# EAGLE design clockshield (EAGLE 5.11)
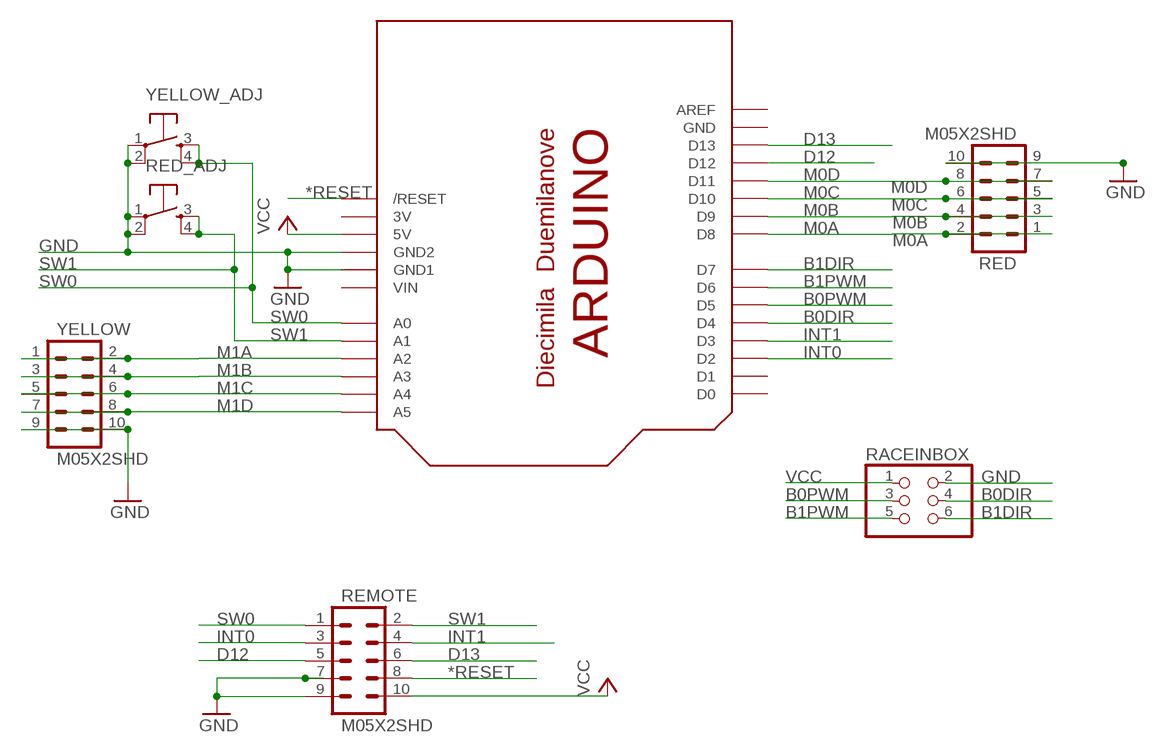
[diagram p0: schematic, sheet 1]

## Parts
RACEINBOX  PINHD-2X3  [2X03]
RED  M05X2SHD  [2X5-SHROUDED]
RED_ADJ  TAC_SWITCHPTH  [TACTILE-PTH]
REMOTE  M05X2SHD  [2X5-SHROUDED]
U$1  ARDUINO-BPLACE  [ARDUINO-BPLACE]
YELLOW  M05X2SHD  [2X5-SHROUDED]
YELLOW_ADJ  TAC_SWITCHPTH  [TACTILE-PTH]

## Nets
*RESET: REMOTE.8 U$1.RESET(/RESET)
B0DIR: RACEINBOX.4 U$1.D4
B0PWM: RACEINBOX.3 U$1.D5
B1DIR: RACEINBOX.6 U$1.D7
B1PWM: RACEINBOX.5 U$1.D6
D12: REMOTE.5 U$1.D12
D13: REMOTE.6 U$1.D13
GND: RACEINBOX.2 RED.9 RED.10 RED_ADJ.1 RED_ADJ.2 REMOTE.7 REMOTE.9 U$1.GND1 U$1.GND2 YELLOW.9 YELLOW.10 YELLOW_ADJ.1 YELLOW_ADJ.2
INT0: REMOTE.3 U$1.D2
INT1: REMOTE.4 U$1.D3
M0A: RED.1 RED.2 U$1.D8
M0B: RED.3 RED.4 U$1.D9
M0C: RED.5 RED.6 U$1.D10
M0D: RED.7 RED.8 U$1.D11
M1A: U$1.A2 YELLOW.1 YELLOW.2
M1B: U$1.A3 YELLOW.3 YELLOW.4
M1C: U$1.A4 YELLOW.5 YELLOW.6
M1D: U$1.A5 YELLOW.7 YELLOW.8
SW0: REMOTE.1 U$1.A0 YELLOW_ADJ.3 YELLOW_ADJ.4
SW1: RED_ADJ.3 RED_ADJ.4 REMOTE.2 U$1.A1
VCC: RACEINBOX.1 REMOTE.10 U$1.5V
Unconnected: U$1.AREF U$1.D0 U$1.D1

## Power pins joined to a net without a drawn wire
3V: U$1.3V
GND: U$1.GND
VIN: U$1.VIN

## Library data of the parts
RACEINBOX = pinhead:PINHD-2X3: PIN HEADER
RED REMOTE YELLOW = 3d2011:M05X2: Header 5x2 Standard 10-pin dual row 0.1" header. Commonly used with AVR-ISP. Use with Spark Fun Electronics SKU: PRT-00778
RED_ADJ YELLOW_ADJ = 3d2011:TAC_SWITCH: Momentary Switch Button commonly used for reset or general input. Spark Fun Electronics SKU : COM-00097
U$1 = adafruit:ARDUINO: Arduino Diecimila/Duemilanove Make a shield with ease, this package has all the named pins as well as the two mounting drill holes and an outline of the USB and DC power connector. The outline is on the DIMENSION layer, so if your board house uses it they will cut the outline to match. http://www.ladyada.net/library/pcb/eaglelibrary.html

## Net classes
0 default: width 0.203 mm

## Board
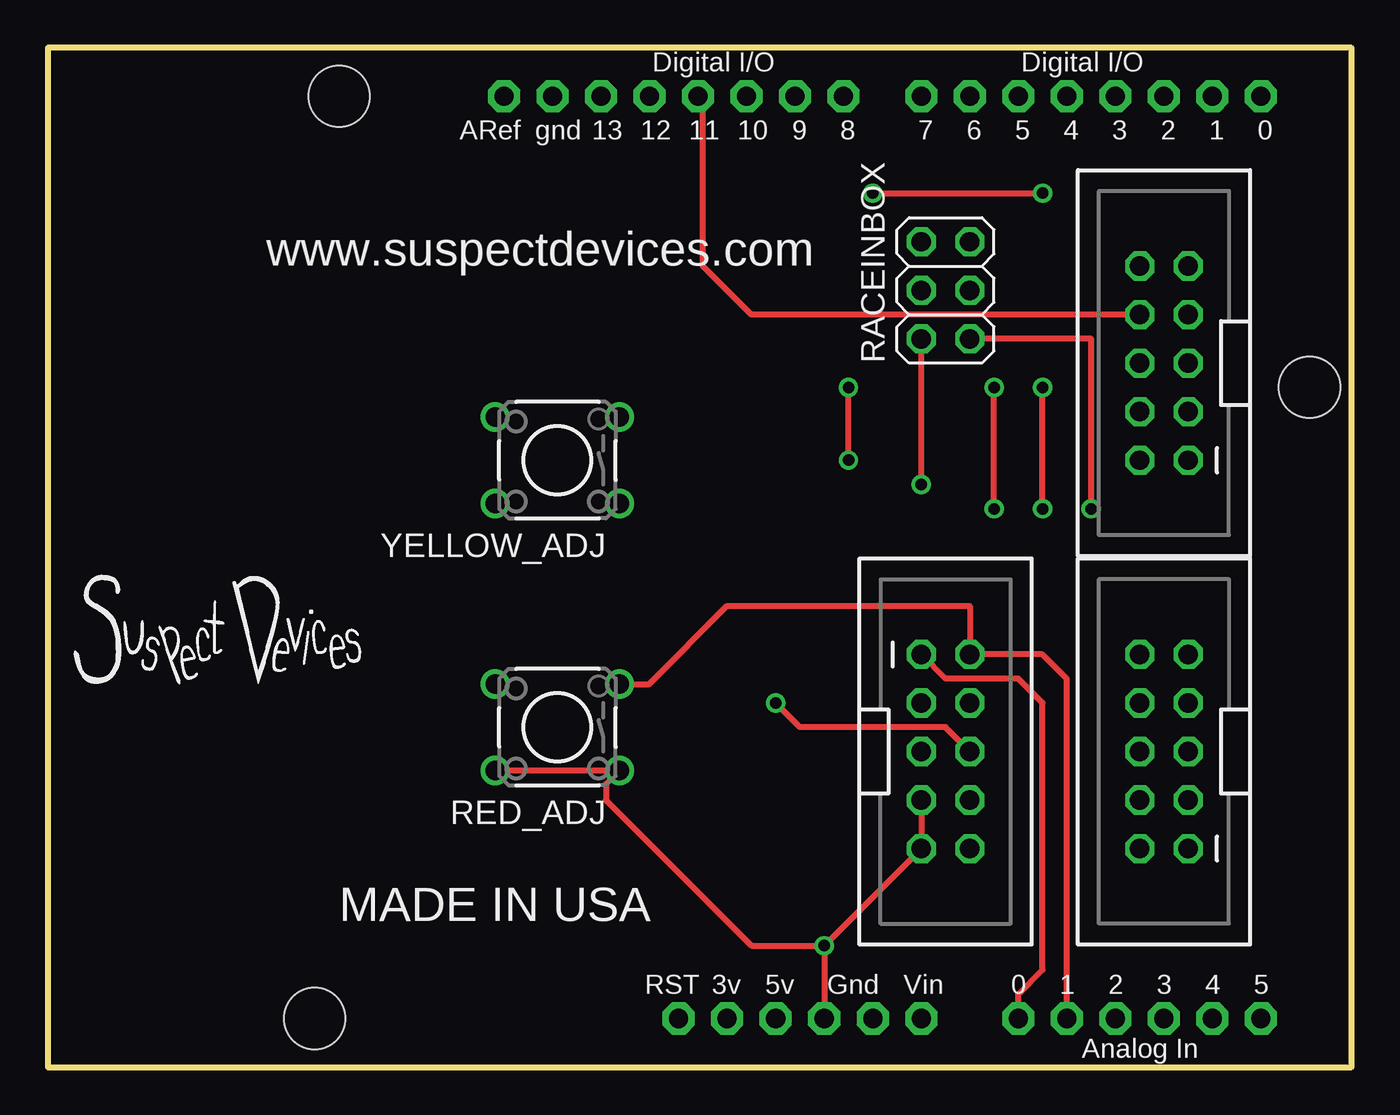
[diagram p1: board, top side]
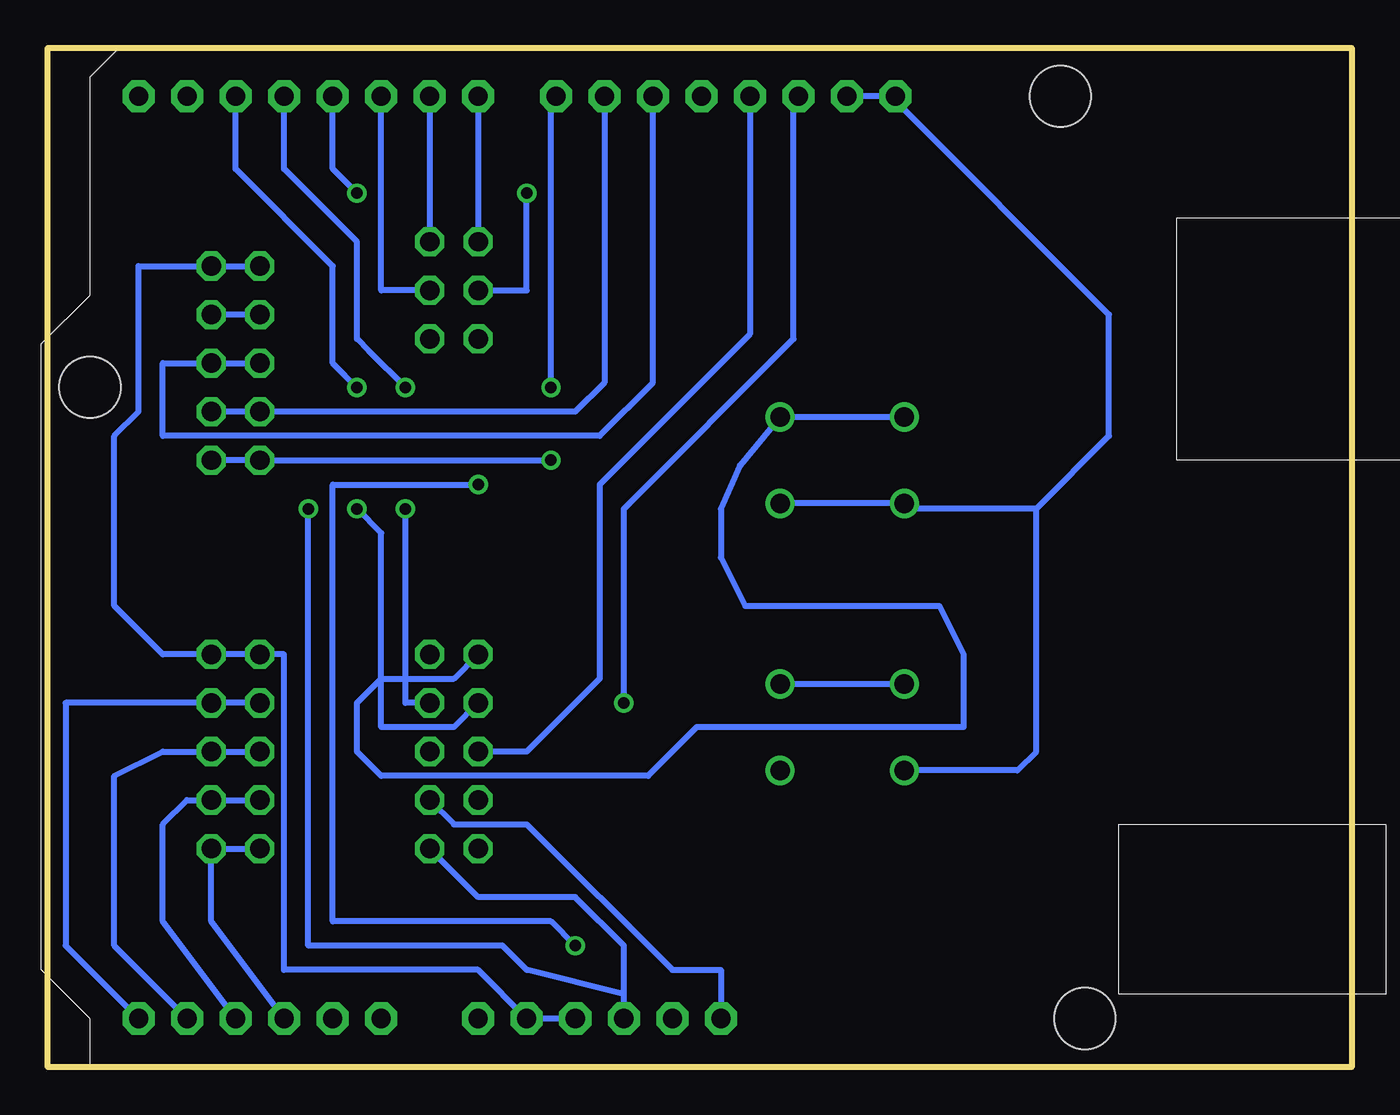
[diagram p2: board, bottom side, seen from below]

Size 68.25 x 53.33 mm. Coordinates in mm from the lower left corner, seen from the top.
Outline: 0,0 68.25,0 68.25,53.33 0,53.33 0,0
Copper layers (1*16): Top 0.035mm / dielectric 1.5mm / Bottom 0.035mm
Design rules "default": minimum track width 10mil, minimum drill 24mil, track to track 8mil, track to pad 8mil, pad to pad 8mil, via to via 8mil, smd to smd 8mil, copper to edge 40mil, drill to drill 8mil, minimum pad ring 10mil, minimum via ring 8mil, stop-mask expansion 4mil, vias tented up to drill 0mil, thermal gap 10mil

### Footprints (pad centres in the part's own frame; a part is rotated, then mirrored left to right if it is on the bottom)
2X03 = drill 1.016 octagon: 1 -2.54,-1.27; 2 -2.54,1.27; 3 0,-1.27; 4 0,1.27; 5 2.54,-1.27; 6 2.54,1.27
2X5-SHROUDED = drill 1.016 octagon: 1 -1.27,5.08; 2 1.27,5.08; 3 -1.27,2.54; 4 1.27,2.54; 5 -1.27,0; 6 1.27,0; 7 -1.27,-2.54; 8 1.27,-2.54; 9 -1.27,-5.08; 10 1.27,-5.08
TACTILE-PTH = drill 1.016 round: 1 -3.251,2.261; 2 3.251,2.261; 3 -3.251,-2.261; 4 3.251,-2.261
ARDUINO-BPLACE = drill 1 pad 1.676 octagon: 3V 35.56,2.54; 5V 38.1,2.54; A0 50.8,2.54; A1 53.34,2.54; A2 55.88,2.54; A3 58.42,2.54; A4 60.96,2.54; A5 63.5,2.54; AREF 23.876,50.8; D0 63.5,50.8; D1 60.96,50.8; D2 58.42,50.8; D3 55.88,50.8; D4 53.34,50.8; D5 50.8,50.8; D6 48.26,50.8; D7 45.72,50.8; D8 41.656,50.8; D9 39.116,50.8; D10 36.576,50.8; D11 34.036,50.8; D12 31.496,50.8; D13 28.956,50.8; GND 26.416,50.8; GND1 43.18,2.54; GND2 40.64,2.54; RESET 33.02,2.54; VIN 45.72,2.54 | hole 3.2: 15.24,50.8; 66.04,35.56; 13.97,2.54

### Placement (x,y rotation side)
RACEINBOX  46.99,40.64 90 top
RED  58.42,36.83 180 top
RED_ADJ  26.67,17.78 180 top
REMOTE  46.99,16.51 0 top
U$1  0,0 0 top
U$2  [SUSDEVLOGOSM]  1.27,20.32 0 top
YELLOW  58.42,16.51 180 top
YELLOW_ADJ  26.67,31.75 180 top

### Tracks (layer width: path | path; a pad name or v marks a point on that pad's centre or on a via)
*RESET
  Bottom 0.305: REMOTE.8 46.99,12.7 43.18,12.7 35.56,5.08 33.02,5.08 U$1.RESET
B0DIR  (via drill 0.6)
  Top 0.305: v43.18,45.72 v52.07,45.72
  Bottom 0.305: RACEINBOX.4 43.18,40.64 v43.18,45.72 | v52.07,45.72 53.34,46.99 U$1.D4
B0PWM
  Bottom 0.305: RACEINBOX.3 50.8,40.64 U$1.D5
B1DIR
  Bottom 0.305: U$1.D7 RACEINBOX.6
B1PWM
  Bottom 0.305: U$1.D6 RACEINBOX.5
D12
  Bottom 0.305: U$1.D12 31.5,38.35 39.37,30.48 39.37,20.32 43.18,16.51 REMOTE.5
D13  (via drill 0.6)
  Top 0.305: REMOTE.6 46.99,17.78 39.37,17.78 v38.1,19.05
  Bottom 0.305: v38.1,19.05 38.1,29.21 29.21,38.1 29.21,50.55 U$1.D13
GND  (via drill 0.6)
  Top 0.305: v40.64,6.35 U$1.GND2 | v45.72,30.48 RACEINBOX.2 | v40.64,6.35 REMOTE.9 REMOTE.7 | v40.64,6.35 36.83,6.35 29.21,13.97 29.21,14.81 RED_ADJ.1 RED_ADJ.2
  Bottom 0.305: RED.10 RED.9 63.5,41.91 63.5,34.29 64.77,33.02 64.77,24.13 62.23,21.59 YELLOW.9 YELLOW.10 55.88,21.59 55.88,5.08 45.72,5.08 U$1.GND1 U$1.GND2 | v40.64,6.35 41.91,7.62 53.34,7.62 53.34,30.48 v45.72,30.48 | U$1.GND 24.13,50.8 12.7,39.37 12.7,33.02 16.51,29.21 | 16.51,29.21 23.14,29.21 YELLOW_ADJ.2 YELLOW_ADJ.1 | RED_ADJ.2 17.5,15.52 16.51,16.51 16.51,29.21
INT0  (via drill 0.6)
  Top 0.305: v52.07,29.21 v52.07,35.56
  Bottom 0.305: U$1.D2 58.42,46.99 53.34,41.91 53.34,36.83 52.7,36.2 v52.07,35.56 | REMOTE.3 46.99,17.78 50.8,17.78 50.8,27.94 v52.07,29.21
INT1  (via drill 0.6)
  Top 0.305: v49.53,29.21 v49.53,35.56
  Bottom 0.305: U$1.D3 55.88,46.99 52.07,43.18 52.07,38.1 51.44,37.47 v49.53,35.56 | REMOTE.4 49.53,19.05 v49.53,29.21
M0A  (via drill 0.6)
  Top 0.305: v41.91,31.75 v41.91,35.56
  Bottom 0.305: RED.1 RED.2 v41.91,31.75 | v41.91,35.56 41.91,50.55 U$1.D8
M0B
  Bottom 0.305: RED.3 RED.4 40.64,34.29 39.12,35.81 U$1.D9
M0C
  Bottom 0.305: RED.6 RED.5 62.23,36.83 62.23,33.02 39.37,33.02 36.58,35.81 U$1.D10
M0D
  Top 0.305: RED.8 36.83,39.37 34.29,41.91 34.29,50.8 U$1.D11
  Bottom 0.305: RED.8 RED.7
M1A
  Bottom 0.305: YELLOW.2 YELLOW.1 59.69,7.62 U$1.A2
M1B
  Bottom 0.305: U$1.A3 62.23,7.62 62.23,12.7 60.96,13.97 YELLOW.3 YELLOW.4
M1C
  Bottom 0.305: U$1.A4 64.77,6.35 64.77,15.24 62.23,16.51 YELLOW.5 YELLOW.6
M1D
  Bottom 0.305: YELLOW.8 YELLOW.7 67.31,19.05 67.31,6.35 U$1.A5
SW0
  Top 0.305: U$1.A0 50.8,3.81 52.07,5.08 52.07,19.05 50.8,20.32 46.99,20.32 REMOTE.1
  Bottom 0.305: YELLOW_ADJ.4 YELLOW_ADJ.3 32.03,31.47 33.02,29.21 33.02,26.67 31.75,24.13 21.59,24.13 20.32,21.59 20.32,17.78 34.29,17.78 36.83,15.24 50.8,15.24 52.07,16.51 52.07,19.05 50.8,20.32 46.99,20.32 REMOTE.1
SW1
  Top 0.305: U$1.A1 53.34,20.32 52.07,21.59 REMOTE.2 48.26,24.13 35.56,24.13 31.47,20.04 RED_ADJ.3
  Bottom 0.305: RED_ADJ.4 RED_ADJ.3
VCC  (via drill 0.6)
  Top 0.305: v54.61,29.21 54.61,38.1 RACEINBOX.1
  Bottom 0.305: 38.1,3.81 43.18,5.08 44.45,6.35 54.61,6.35 v54.61,29.21 | U$1.5V 38.1,3.81 | 38.1,3.81 38.1,6.35 40.64,8.89 45.72,8.89 REMOTE.10

### Text on the board
tNames: www.suspectdevices.com | MADE IN USA